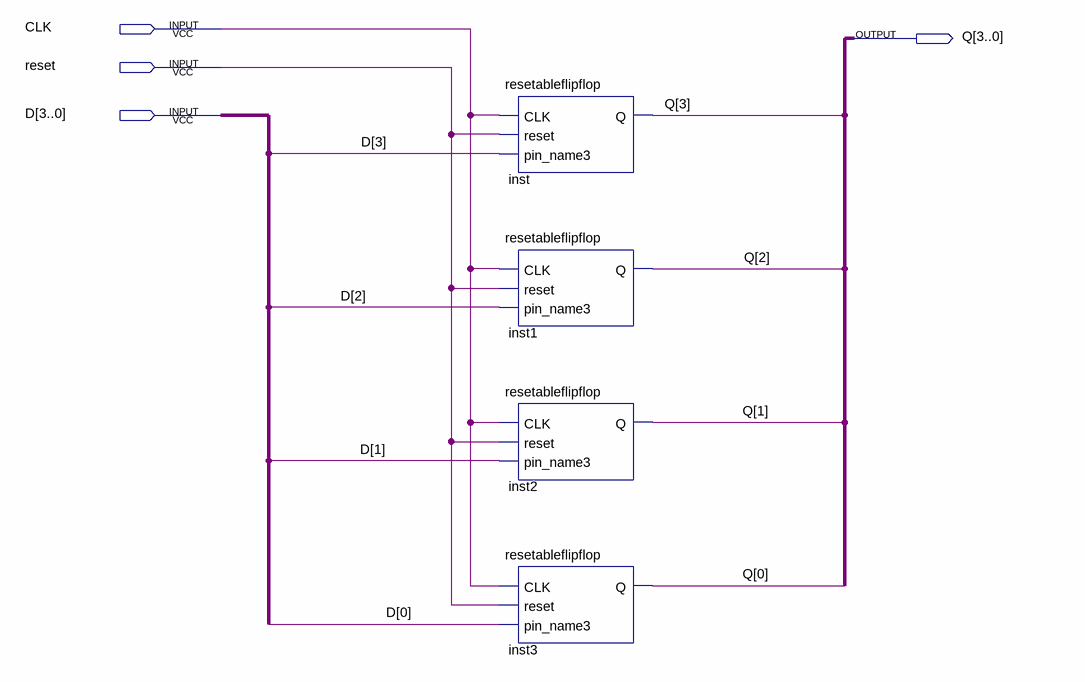
[diagram p0: schematic sheet]
// Quartus schematic fourbitregister.bdf as structural Verilog: 4 symbols, 4 pins
module fourbitregister (
  input  CLK,
  input  reset,
  input  [3:0] D,
  output [3:0] Q
);

  resetableflipflop inst (.CLK(CLK), .reset(reset), .pin_name3(D[3]), .Q(Q[3]));
  resetableflipflop inst1 (.CLK(CLK), .reset(reset), .pin_name3(D[2]), .Q(Q[2]));
  resetableflipflop inst2 (.CLK(CLK), .reset(reset), .pin_name3(D[1]), .Q(Q[1]));
  resetableflipflop inst3 (.CLK(CLK), .reset(reset), .pin_name3(D[0]), .Q(Q[0]));
endmodule
